# Altium schematic sheet DIO.SchDoc
size A4; DrawnBy: Copyright © 2023 by; Engineer: Artyom Kislevitz Lee; Revision: A
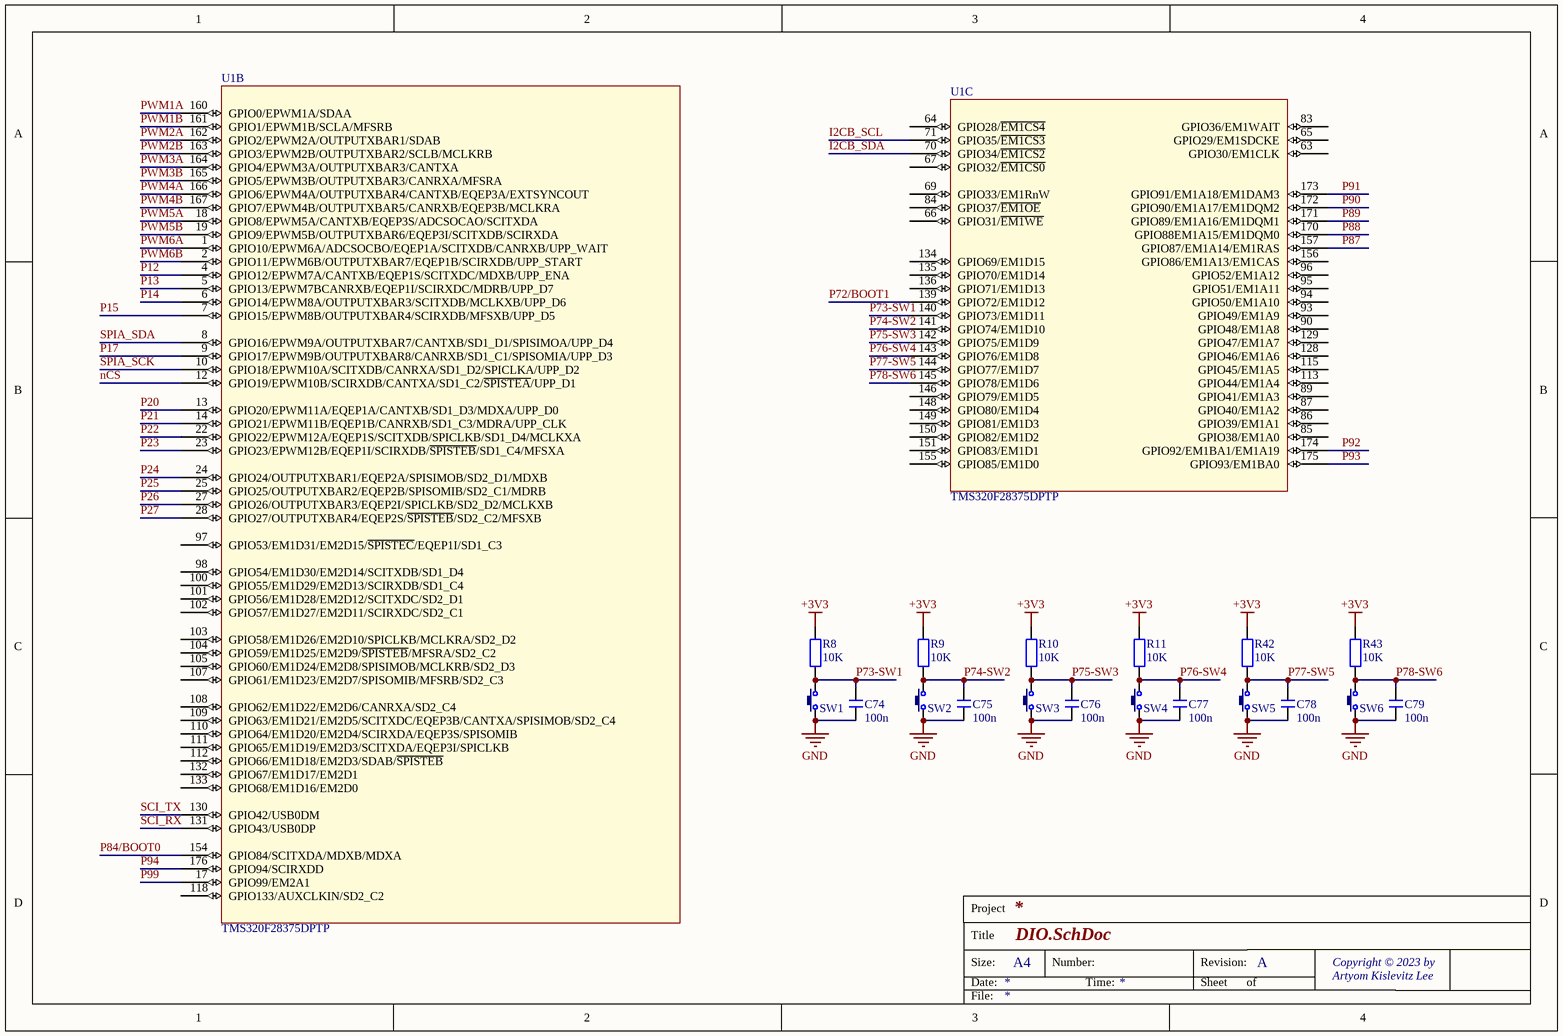
[diagram p0: DIO.SchDoc]

## Parts
C74  100n  [C 0805_L]
C75  100n  [C 0805_L]
C76  100n  [C 0805_L]
C77  100n  [C 0805_L]
C78  100n  [C 0805_L]
C79  100n  [C 0805_L]
R8  10K  [R 0805_L]
R9  10K  [R 0805_L]
R10  10K  [R 0805_L]
R11  10K  [R 0805_L]
R42  10K  [R 0805_L]
R43  10K  [R 0805_L]
SW1  3x6x5  [TSW DIP-3*6*4.3]  (value not drawn)
SW2  3x6x5  [TSW DIP-3*6*4.3]  (value not drawn)
SW3  3x6x5  [TSW DIP-3*6*4.3]  (value not drawn)
SW4  3x6x5  [TSW DIP-3*6*4.3]  (value not drawn)
SW5  3x6x5  [TSW DIP-3*6*4.3]  (value not drawn)
SW6  3x6x5  [TSW DIP-3*6*4.3]  (value not drawn)
U1  TMS320F28375DPTP  [LQFP176-E 24x24_N]  (parts B,C of 5)

## Nets
+3V3: R8.2 R9.2 R10.2 R11.2 R42.2 R43.2
GND: C74.1 C75.1 C76.1 C77.1 C78.1 C79.1 SW1.1 SW2.1 SW3.1 SW4.1 SW5.1 SW6.1
I2CB_SCL: U1.71(GPIO35/~{EM1CS3})
I2CB_SDA: U1.70(GPIO34/~{EM1CS2})
nCS: U1.12(GPIO19/EPWM10B/SCIRXDB/CANTXA/SD1_C2/~{SPISTEA}/UPP_D1)
P12: U1.4(GPIO12/EPWM7A/CANTXB/EQEP1S/SCITXDC/MDXB/UPP_ENA)
P13: U1.5(GPIO13/EPWM7BCANRXB/EQEP1I/SCIRXDC/MDRB/UPP_D7)
P14: U1.6(GPIO14/EPWM8A/OUTPUTXBAR3/SCITXDB/MCLKXB/UPP_D6)
P15: U1.7(GPIO15/EPWM8B/OUTPUTXBAR4/SCIRXDB/MFSXB/UPP_D5)
P17: U1.9(GPIO17/EPWM9B/OUTPUTXBAR8/CANRXB/SD1_C1/SPISOMIA/UPP_D3)
P20: U1.13(GPIO20/EPWM11A/EQEP1A/CANTXB/SD1_D3/MDXA/UPP_D0)
P21: U1.14(GPIO21/EPWM11B/EQEP1B/CANRXB/SD1_C3/MDRA/UPP_CLK)
P22: U1.22(GPIO22/EPWM12A/EQEP1S/SCITXDB/SPICLKB/SD1_D4/MCLKXA)
P23: U1.23(GPIO23/EPWM12B/EQEP1I/SCIRXDB/~{SPISTEB}/SD1_C4/MFSXA)
P24: U1.24(GPIO24/OUTPUTXBAR1/EQEP2A/SPISIMOB/SD2_D1/MDXB)
P25: U1.25(GPIO25/OUTPUTXBAR2/EQEP2B/SPISOMIB/SD2_C1/MDRB)
P26: U1.27(GPIO26/OUTPUTXBAR3/EQEP2I/SPICLKB/SD2_D2/MCLKXB)
P27: U1.28(GPIO27/OUTPUTXBAR4/EQEP2S/~{SPISTEB}/SD2_C2/MFSXB)
P72/BOOT1: U1.139(GPIO72/EM1D12)
P73-SW1: C74.2 R8.1 SW1.2 U1.140(GPIO73/EM1D11)
P74-SW2: C75.2 R9.1 SW2.2 U1.141(GPIO74/EM1D10)
P75-SW3: C76.2 R10.1 SW3.2 U1.142(GPIO75/EM1D9)
P76-SW4: C77.2 R11.1 SW4.2 U1.143(GPIO76/EM1D8)
P77-SW5: C78.2 R42.1 SW5.2 U1.144(GPIO77/EM1D7)
P78-SW6: C79.2 R43.1 SW6.2 U1.145(GPIO78/EM1D6)
P84/BOOT0: U1.154(GPIO84/SCITXDA/MDXB/MDXA)
P87: U1.157(GPIO87/EM1A14/EM1RAS)
P88: U1.170(GPIO88EM1A15/EM1DQM0)
P89: U1.171(GPIO89/EM1A16/EM1DQM1)
P90: U1.172(GPIO90/EM1A17/EM1DQM2)
P91: U1.173(GPIO91/EM1A18/EM1DAM3)
P92: U1.174(GPIO92/EM1BA1/EM1A19)
P93: U1.175(GPIO93/EM1BA0)
P94: U1.176(GPIO94/SCIRXDD)
P99: U1.17(GPIO99/EM2A1)
PWM1A: U1.160(GPIO0/EPWM1A/SDAA)
PWM1B: U1.161(GPIO1/EPWM1B/SCLA/MFSRB)
PWM2A: U1.162(GPIO2/EPWM2A/OUTPUTXBAR1/SDAB)
PWM2B: U1.163(GPIO3/EPWM2B/OUTPUTXBAR2/SCLB/MCLKRB)
PWM3A: U1.164(GPIO4/EPWM3A/OUTPUTXBAR3/CANTXA)
PWM3B: U1.165(GPIO5/EPWM3B/OUTPUTXBAR3/CANRXA/MFSRA)
PWM4A: U1.166(GPIO6/EPWM4A/OUTPUTXBAR4/CANTXB/EQEP3A/EXTSYNCOUT)
PWM4B: U1.167(GPIO7/EPWM4B/OUTPUTXBAR5/CANRXB/EQEP3B/MCLKRA)
PWM5A: U1.18(GPIO8/EPWM5A/CANTXB/EQEP3S/ADCSOCAO/SCITXDA)
PWM5B: U1.19(GPIO9/EPWM5B/OUTPUTXBAR6/EQEP3I/SCITXDB/SCIRXDA)
PWM6A: U1.1(GPIO10/EPWM6A/ADCSOCBO/EQEP1A/SCITXDB/CANRXB/UPP_WAIT)
PWM6B: U1.2(GPIO11/EPWM6B/OUTPUTXBAR7/EQEP1B/SCIRXDB/UPP_START)
SCI_RX: U1.131(GPIO43/USB0DP)
SCI_TX: U1.130(GPIO42/USB0DM)
SPIA_SCK: U1.10(GPIO18/EPWM10A/SCITXDB/CANRXA/SD1_D2/SPICLKA/UPP_D2)
SPIA_SDA: U1.8(GPIO16/EPWM9A/OUTPUTXBAR7/CANTXB/SD1_D1/SPISIMOA/UPP_D4)

Not connected (* = marked no-connect by the designer): U1 63(GPIO30/EM1CLK) 64(GPIO28/~{EM1CS4}) 65(GPIO29/EM1SDCKE) 66(GPIO31/~{EM1WE}) 67(GPIO32/~{EM1CS0}) 69(GPIO33/EM1RnW) 83(GPIO36/EM1WAIT) 84(GPIO37/~{EM1OE}) 85(GPIO38/EM1A0) 86(GPIO39/EM1A1) 87(GPIO40/EM1A2) 89(GPIO41/EM1A3) 90(GPIO48/EM1A8) 93(GPIO49/EM1A9) 94(GPIO50/EM1A10) 95(GPIO51/EM1A11) 96(GPIO52/EM1A12) 97(GPIO53/EM1D31/EM2D15/~{SPISTEC}/EQEP1I/SD1_C3) 98(GPIO54/EM1D30/EM2D14/SCITXDB/SD1_D4) 100(GPIO55/EM1D29/EM2D13/SCIRXDB/SD1_C4) 101(GPIO56/EM1D28/EM2D12/SCITXDC/SD2_D1) 102(GPIO57/EM1D27/EM2D11/SCIRXDC/SD2_C1) 103(GPIO58/EM1D26/EM2D10/SPICLKB/MCLKRA/SD2_D2) 104(GPIO59/EM1D25/EM2D9/~{SPISTEB}/MFSRA/SD2_C2) 105(GPIO60/EM1D24/EM2D8/SPISIMOB/MCLKRB/SD2_D3) 107(GPIO61/EM1D23/EM2D7/SPISOMIB/MFSRB/SD2_C3) 108(GPIO62/EM1D22/EM2D6/CANRXA/SD2_C4) 109(GPIO63/EM1D21/EM2D5/SCITXDC/EQEP3B/CANTXA/SPISIMOB/SD2_C4) 110(GPIO64/EM1D20/EM2D4/SCIRXDA/EQEP3S/SPISOMIB) 111(GPIO65/EM1D19/EM2D3/SCITXDA/EQEP3I/SPICLKB) 112(GPIO66/EM1D18/EM2D3/SDAB/~{SPISTEB}) 113(GPIO44/EM1A4) 115(GPIO45/EM1A5) 118(GPIO133/AUXCLKIN/SD2_C2) 128(GPIO46/EM1A6) 129(GPIO47/EM1A7) 132(GPIO67/EM1D17/EM2D1) 133(GPIO68/EM1D16/EM2D0) 134(GPIO69/EM1D15) 135(GPIO70/EM1D14) 136(GPIO71/EM1D13) 146(GPIO79/EM1D5) 148(GPIO80/EM1D4) 149(GPIO81/EM1D3) 150(GPIO82/EM1D2) 151(GPIO83/EM1D1) 155(GPIO85/EM1D0) 156(GPIO86/EM1A13/EM1CAS)

## Notes on the sheet
- Project
- Title
- Size:
- Date:
- A4
- Number:
- Time:
- Revision:
- Sheet
- of
- Copyright © 2023 by
- Artyom Kislevitz Lee
- File:

## Library data of the parts
C74-C79 = C: 贴片电容; 淘宝ID: 小糖豆的小窝窝; BOM名称: 贴片电容; 下单链接: https://item.taobao.com/item.htm?ft=t&id=613637044352
R8-R11 R42 R43 = R: 贴片电阻; 淘宝ID: 小糖豆的小窝窝; BOM名称: 贴片电阻; 下单链接: https://item.taobao.com/item.htm?ft=t&id=613637044352
SW1-SW6 = TSW 3x6: 3x6轻触开关; 淘宝ID: 小糖豆的小窝窝; BOM名称: 3x6轻触开关; 下单链接: https://item.taobao.com/item.htm?ft=t&id=613637044352
U1 = TMS320F28377DPTP: DSP 176; Manufacturer: Texas Instruments; CompType: IC; PIN_COUNT: 177; PartNumber: TMS320F28377DPTP; PackageReference: PTP0176F; MountType: SMT; RoHS: Y; RefDes: RefDes; Type: DEV; Value: Value